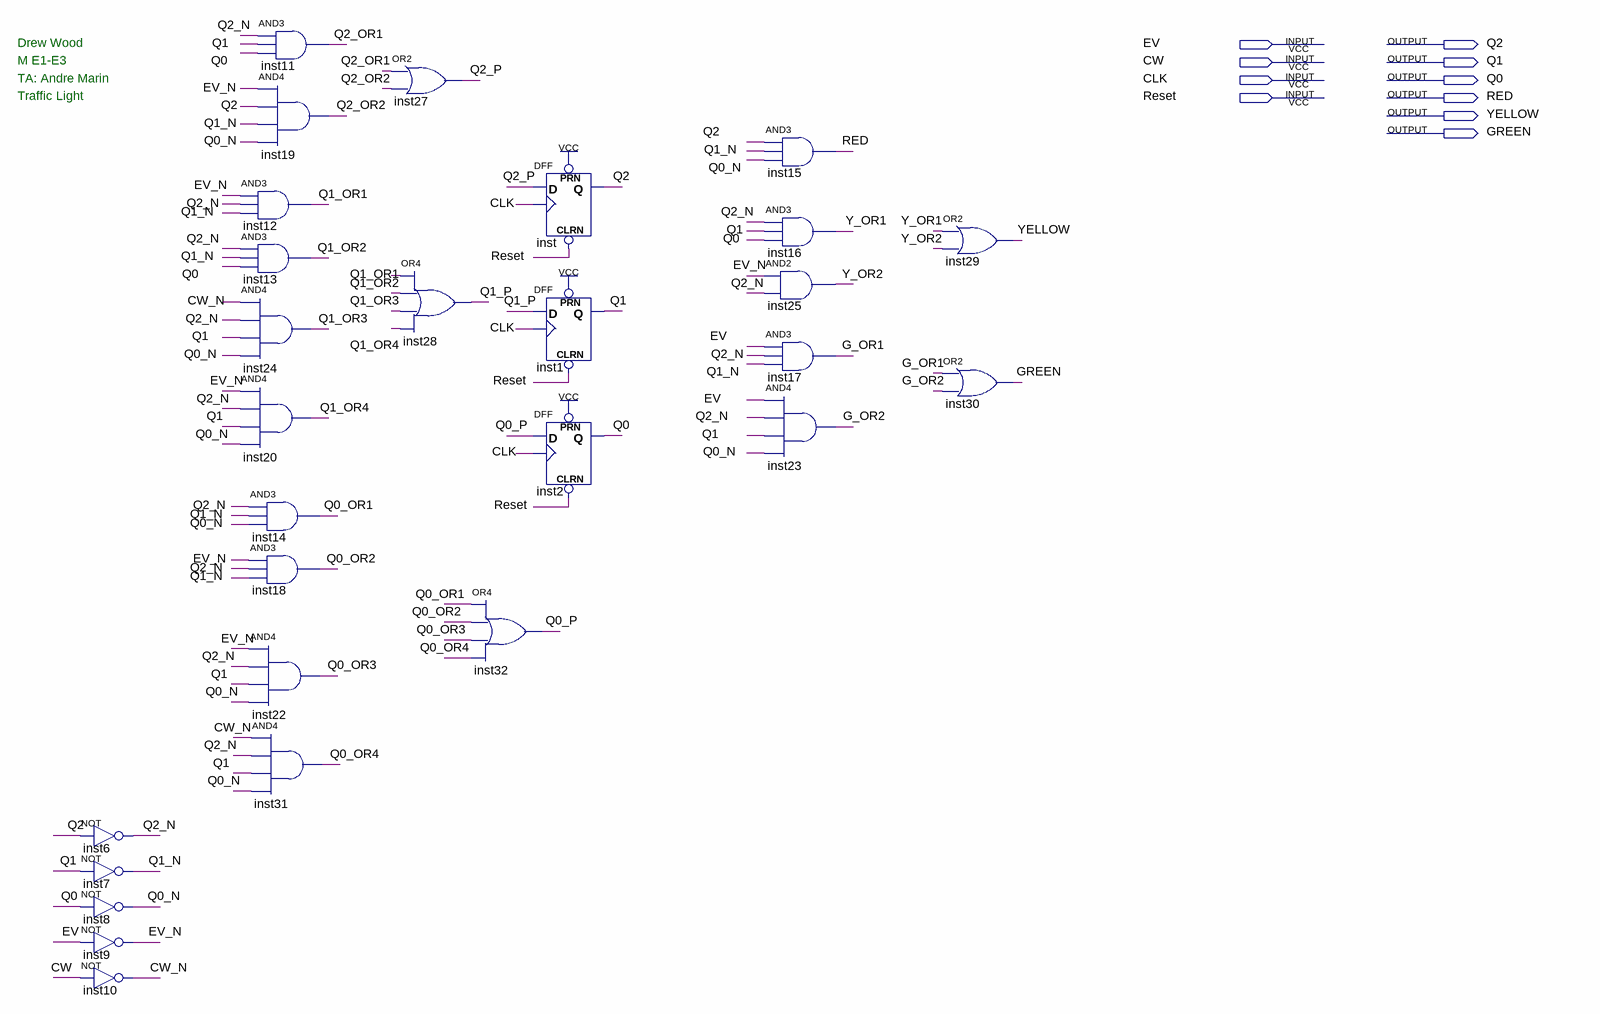
[diagram p0: schematic sheet]
// Quartus schematic lab7_part2.bdf as structural Verilog: 28 symbols, 10 pins
module lab7_part2 (
  input  EV,
  input  CW,
  input  CLK,
  input  Reset,
  output Q2,
  output Q1,
  output Q0,
  output RED,
  output YELLOW,
  output GREEN
);

  wire CW_N, EV_N, G_OR1, G_OR2, Q0_N, Q0_OR1, Q0_OR2, Q0_OR3, Q0_OR4, Q0_P, Q1_N, Q1_OR1, Q1_OR2, Q1_OR3,
       Q1_OR4, Q1_P, Q2_N, Q2_OR1, Q2_OR2, Q2_P, Y_OR1, Y_OR2;

  not inst6 (Q2_N, Q2);
  not inst7 (Q1_N, Q1);
  not inst8 (Q0_N, Q0);
  not inst9 (EV_N, EV);
  not inst10 (CW_N, CW);
  and inst11 (Q2_OR1, Q2_N, Q1, Q0);
  and inst19 (Q2_OR2, EV_N, Q2, Q1_N, Q0_N);
  and inst12 (Q1_OR1, EV_N, Q2_N, Q1_N);
  and inst13 (Q1_OR2, Q2_N, Q1_N, Q0);
  and inst24 (Q1_OR3, CW_N, Q2_N, Q1, Q0_N);
  and inst20 (Q1_OR4, EV_N, Q2_N, Q1, Q0_N);
  and inst14 (Q0_OR1, Q2_N, Q1_N, Q0_N);
  and inst18 (Q0_OR2, EV_N, Q2_N, Q1_N);
  and inst22 (Q0_OR3, EV_N, Q2_N, Q1, Q0_N);
  and inst31 (Q0_OR4, CW_N, Q2_N, Q1, Q0_N);
  or inst27 (Q2_P, Q2_OR1, Q2_OR2);
  or inst28 (Q1_P, Q1_OR1, Q1_OR2, Q1_OR3, Q1_OR4);
  or inst32 (Q0_P, Q0_OR1, Q0_OR2, Q0_OR3, Q0_OR4);
  DFF inst (.CLRN(Reset), .CLK(CLK), .D(Q2_P), .PRN(1'b1), .Q(Q2));
  DFF inst1 (.CLRN(Reset), .CLK(CLK), .D(Q1_P), .PRN(1'b1), .Q(Q1));
  DFF inst2 (.CLRN(Reset), .CLK(CLK), .D(Q0_P), .PRN(1'b1), .Q(Q0));
  and inst15 (RED, Q2, Q1_N, Q0_N);
  and inst16 (Y_OR1, Q2_N, Q1, Q0);
  and inst25 (Y_OR2, EV_N, Q2_N);
  and inst17 (G_OR1, EV, Q2_N, Q1_N);
  and inst23 (G_OR2, EV, Q2_N, Q1, Q0_N);
  or inst29 (YELLOW, Y_OR1, Y_OR2);
  or inst30 (GREEN, G_OR1, G_OR2);

  // Notes on the sheet:
  //   Drew Wood
  //   M E1-E3
  //   TA: Andre Marin
  //   Traffic Light
endmodule
